# Altium schematic sheet Misc.SchDoc: Flight Computer Prototype
size A4; Organization: Altium Limited; Address1: L3, 12a Rodborough Rd; Address2: Frenchs Forest; Address3: NSW; Address4: Australia 2086; Revision: 1.0; SheetNumber: 4; SheetTotal: 4
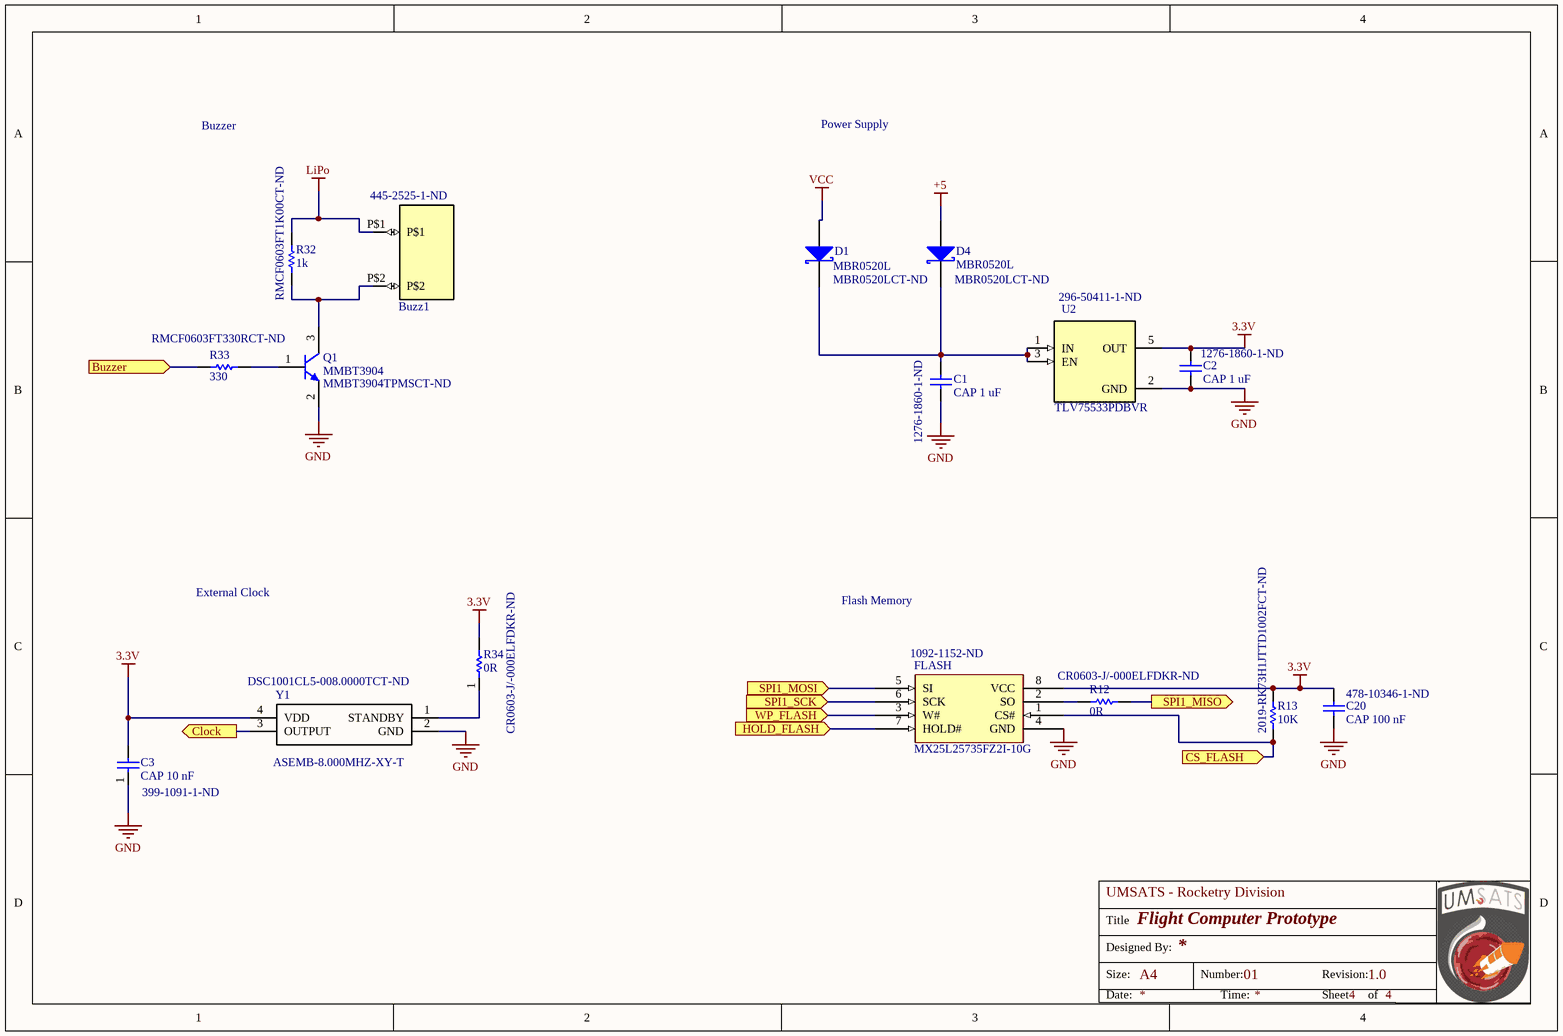
[diagram p0: Misc.SchDoc]

## Parts
Buzz1  Supplier Part Number 1: 445-2525-1-ND  [*PS1240P02BT_PS1240P02BT(Primary)]  (hidden comment: PS1240P02BT)
C1  CAP 1 uF  Supplier Part Number 1: 1276-1860-1-ND  [CL10A105KB8NNNC]
C2  CAP 1 uF  Supplier Part Number 1: 1276-1860-1-ND  [CL10A105KB8NNNC]
C3  CAP 10 nF  Supplier Part Number 1: 399-1091-1-ND  [06035C104KAT4A]
C20  CAP 100 nF  Supplier Part Number 1: 478-10346-1-ND  [06035C104KAT4A]
D1  MBR0520L  Supplier Part Number 1: MBR0520LCT-ND  [ON_Semi_CASE_425_0]
D4  MBR0520L  Supplier Part Number 1: MBR0520LCT-ND  [ON_Semi_CASE_425_0]
FLASH  MX25L25735FZ2I-10G  Supplier Part Number 1: 1092-1152-ND  [SON127P800X80_HS-9N]
Q1  MMBT3904  Supplier Part Number 1: MMBT3904TPMSCT-ND  [FAIR-SOT23-3_V]
R12  0R  Supplier Part Number 1: CR0603-J/-000ELFDKR-ND  [CR0603-J/-000ELF]
R13  10K  Supplier Part Number 1: 2019-RK73H1JTTD1002FCT-ND  [RK73H1JTTD1002F]
R32  1k  Supplier Part Number 1: RMCF0603FT1K00CT-ND  [CR0603-J/-000ELF]
R33  330  Supplier Part Number 1: RMCF0603FT330RCT-ND  [CR0603-J/-000ELF]
R34  0R  Supplier Part Number 1: CR0603-J/-000ELFDKR-ND  [CR0603-J/-000ELF]
U2  TLV75533PDBVR  Supplier Part Number 1: 296-50411-1-ND  [SOT95P280X145-5N]
Y1  ASEMB-8.000MHZ-XY-T  Supplier Part Number 1: DSC1001CL5-008.0000TCT-ND  [ASEMB]

## Ports
Buzzer (in), Clock (out), CS_FLASH (in), HOLD_FLASH (in), SPI1_MISO (out), SPI1_MOSI (in), SPI1_SCK (in), WP_FLASH (in)

## Nets
3.3V: C2.1 C3.2 C20.1 FLASH.8(VCC) R13.2 R34.2 U2.5(OUT) Y1.4(VDD)
+5: D4.1(A)
GND: C1.2 C2.2 C3.1 C20.2 FLASH.4(GND) Q1.2(E) U2.2(GND) Y1.2(GND)
LiPo: Buzz1.P$1 R32.2
VCC: D1.1(A)
Buzzer: R33.1 ; port Buzzer
Clock: Y1.3(OUTPUT) ; port Clock
CS_FLASH: FLASH.1(CS#) R13.1 ; port CS_FLASH
HOLD_FLASH: FLASH.7(HOLD#) ; port HOLD_FLASH
SPI1_MISO: R12.2 ; port SPI1_MISO
SPI1_MOSI: FLASH.5(SI) ; port SPI1_MOSI
SPI1_SCK: FLASH.6(SCK) ; port SPI1_SCK
WP_FLASH: FLASH.3(W#) ; port WP_FLASH
NetBuzz1_P$2: Buzz1.P$2 Q1.3(C) R32.1
NetC1_1: C1.1 D1.2(K) D4.2(K) U2.1(IN) U2.3(EN)
NetFLASH_2: FLASH.2(SO) R12.1
NetQ1_1: Q1.1(B) R33.2
NetR34_1: R34.1 Y1.1(STANDBY)

## Notes on the sheet
- Buzzer
- Power Supply
- External Clock
- Flash Memory
- Title
- UMSATS - Rocketry Division
- Designed By:
- Size:
- A4
- Number:
- 01
- Revision:
- Date:
- Time:
- Sheet
- of

## Library data of the parts
Buzz1 = PS1240P02BT: Audio Buzzer Piezo 30Vo-p 3Vo-p 70dBA Pin Through Hole T/R; MF: TDK; MP: PS1240P02BT; Price: None; Availability: Unavailable; Package: 2020 TDK; SnapEDA_Link: https://www.snapeda.com/parts/PS1240P02BT/TDK-Lambda%20Americas%20Inc/view-part/?ref=snap; Value: *; Supplier 1: Digi-Key
C1-C3 C20 = Cap: Capacitor; Published: 8-Jun-2000; LatestRevisionDate: 17-Jul-2002; LatestRevisionNote: Re-released for DXP Platform.; Publisher: Altium Limited; Supplier 1: Digi-Key
D1 D4 = MBR0520L: Schottky Diode; Manufacturer: ON Semiconductor / Fairchild; Average Rectified Current: 500mA; Max Reverse Voltage (DC): 20V; Element Configuration: Single; Forward Voltage: 385mV; Max Surge Current: 5.5A; Peak Reverse Current: 250uA; Polarity: Standard; Power Dissipation: 400mW; Capacitance: 4pF; Current Rating: 500A; Manufacturer Part Number: MBR0520L; RoHS: Yes; Mount: Surface Mount; Number of Pins: 2; Weight: 0.03g; Min Operating Temperature: -65°C; Max Operating Temperature: 125°C; Packaging: Tape and Reel; Package Quantity: 3000; Max Forward Surge Current (Ifsm): 5.5A; Forward Current: 500mA; Max Repetitive Reverse Voltage (Vrrm): 20V; Peak Non-Repetitive Surge Current: 5.5A; Max Reverse Leakage Current: 250uA; Voltage Rating (DC): 20V; Output Current: 500mA; Length: 2.7mm; Height: 1.03mm; Width: 1.6mm; Radiation Hardening: No; Lead Free: Lead Free; REACH SVHC: No SVHC; ComponentLink1URL: http://www.farnell.com/datasheets/2304093.pdf?src-supplier=Farnell; ComponentLink1Description: http://www.farnell.com/datasheets/2304093.pdf?src-supplier=Farnell; ComponentLink2URL: http://www.mouser.com/ds/2/149/MBR0520L-67539.pdf?src-supplier=Mouser; ComponentLink2Description: http://www.mouser.com/ds/2/149/MBR0520L-67539.pdf?src-supplier=Mouser; ComponentLink3URL: https://www.fairchildsemi.com/datasheets/MB/MBR0520L.pdf?src-supplier=Digi-Key; ComponentLink3Description: https://www.fairchildsemi.com/datasheets/MB/MBR0520L.pdf?src-supplier=Digi-Key; ComponentLink4URL: https://www.fairchildsemi.com/datasheets/MB/MBR0520L.pdf?src-supplier=Avnet; ComponentLink4Description: https://www.fairchildsemi.com/datasheets/MB/MBR0520L.pdf?src-supplier=Avnet; ComponentLink5URL: http://www.fairchildsemi.com/ds/MB/MBR0520L.pdf?src-supplier=Avnet+Europe; ComponentLink5Description: http://www.fairchildsemi.com/ds/MB/MBR0520L.pdf?src-supplier=Avnet+Europe; ComponentLink6URL: http://www.jameco.com/Jameco/Products/ProdDS/871594.pdf?src-supplier=Jameco; ComponentLink6Description: http://www.jameco.com/Jameco/Products/ProdDS/871594.pdf?src-supplier=Jameco; ComponentLink7URL: http://www.fairchildsemi.com/ds/MB/MBR0520L.pdf?src-supplier=Future+Electronics; ComponentLink7Description: http://www.fairchildsemi.com/ds/MB/MBR0520L.pdf?src-supplier=Future+Electronics; ComponentLink8URL: http://www.farnell.com/datasheets/48015.pdf?src-supplier=Element14; ComponentLink8Description: http://www.farnell.com/datasheets/48015.pdf?src-supplier=Element14; Supplier 1: Digi-Key
FLASH = S25FL064P: MX25L25735F 256 Mb Flash Memory; Supplier 1: Digi-Key
Q1 = CMP-1670-00008-1: NPN General Purpose Amplifier, 40 V, 0.2 A, -55 to 150 degC, 3-Pin SOT23, RoHS, Tape and Reel; Tolerance: 30ppm; Capacitance: 1.8E-11 f; Frequency: 12.288 MHz; ESR: 40 Ohm; Load Capacitance: 18 pF; REACH SVHC: No SVHC; Pins: 4; ComponentLink3URL: http://www.fairchildsemi.com/dwg/MA/MA03D.pdf; PackageDescription: 3-Pin Small Outline Transistor, Body 2.92 x 1.325 mm, Pitch 0.95 mm; ComponentLink1URL: https://www.fairchildsemi.com/; Max Operating Temperature: 70degC; PackageReference: SOT23-3; ComponentLink1Description: Manufacturer URL; Width: 0.126 inch; Min Operating Temperature: -20degC; DatasheetVersion: Rev. 1.1.0, 10/2014; Mount: Surface Mount; Height: 0.041 inch; Package Quantity: 1000; Frequency Tolerance: 30ppm; Packaging: Tape and Reel; ComponentLink2URL: https://www.fairchildsemi.com/datasheets/MM/MMBT3904.pdf; RoHSCompliant: True; ComponentLink3Description: Package Specification; ComponentLink2Description: Datasheet; Length: 0.197 inch; Supplier 1: Digi-Key
R12 R13 R33 R34 = Res1: Resistor; Value: 1K; Published: 8-Jun-2000; LatestRevisionDate: 17-Jul-2002; LatestRevisionNote: Re-released for DXP Platform.; PackageReference: AXIAL-0.3; Publisher: Altium Limited; PackageDescription: Axial Device, Thru-Hole; 2 Leads; 0.3 in Pin Spacing; Supplier 1: Digi-Key
R32 = Res1: Resistor; Published: 8-Jun-2000; LatestRevisionDate: 17-Jul-2002; LatestRevisionNote: Re-released for DXP Platform.; PackageReference: AXIAL-0.3; Publisher: Altium Limited; PackageDescription: Axial Device, Thru-Hole; 2 Leads; 0.3 in Pin Spacing; Value: 1K; Supplier 1: Digi-Key
U2 = TLV75533PDBVR: 500mA Low-IQ Small-Size Low-Dropout _LDO_ Regulator 5-SOT-23 -40 to 125; MF: Texas Instruments; Package: SOT-23 Texas Instruments; MP: TLV75533PDBVR; SnapEDA_Link: https://www.snapeda.com/parts/TLV75533PDBVR/Texas%20Instruments/view-part/?ref=snap; Availability: Unavailable; Price: None; Value: *; Supplier 1: Digi-Key
Y1 = ASEMB-8.000MHZ-XY-T: Crystal or Oscillator; Manufacturer_Name: ABRACON; Datasheet Link: https://abracon.com/Oscillators/ASEMB.pdf; Manufacturer_Part_Number: ASEMB-8.000MHZ-XY-T; Mouser Part Number: 815-ASEMB-8-XY-T; Mouser Price/Stock: https://www.mouser.com/Search/Refine.aspx?Keyword=815-ASEMB-8-XY-T; Supplier 1: Digi-Key